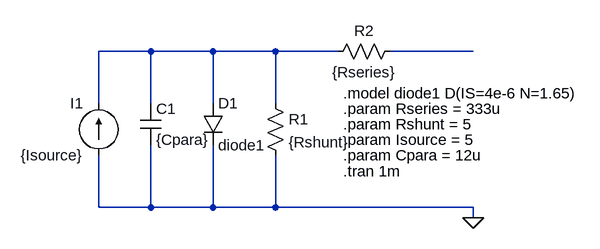
[diagram p0: schematic singlecell.asc]
singlecell.asc, the LTspice schematic file:
Version 4
SHEET 1 1844 680
WIRE 64 32 -16 32
WIRE 160 32 64 32
WIRE 256 32 160 32
WIRE 352 32 256 32
WIRE 560 32 432 32
WIRE -16 112 -16 32
WIRE 64 112 64 32
WIRE 160 112 160 32
WIRE 256 112 256 32
WIRE -16 272 -16 192
WIRE 64 272 64 176
WIRE 64 272 -16 272
WIRE 160 272 160 176
WIRE 160 272 64 272
WIRE 256 272 256 192
WIRE 256 272 160 272
WIRE 560 272 256 272
WIRE 560 288 560 272
FLAG 560 288 0
SYMBOL current -16 192 R180
WINDOW 0 24 80 Left 2
WINDOW 3 24 0 Left 2
WINDOW 123 0 0 Left 2
WINDOW 39 0 0 Left 2
SYMATTR InstName I1
SYMATTR Value {Isource}
SYMBOL cap 48 112 R0
SYMATTR InstName C1
SYMATTR Value {Cpara}
SYMBOL diode 144 112 R0
SYMATTR InstName D1
SYMATTR Value diode1
SYMBOL res 240 96 R0
SYMATTR InstName R1
SYMATTR Value {Rshunt}
SYMBOL res 448 16 R90
WINDOW 0 0 56 VBottom 2
WINDOW 3 32 56 VTop 2
SYMATTR InstName R2
SYMATTR Value {Rseries}
TEXT 360 96 Left 2 !.model diode1 D(IS=4e-6 N=1.65)
TEXT 360 216 Left 2 !.tran 1m
TEXT 360 144 Left 2 !.param Rshunt = 5
TEXT 360 120 Left 2 !.param Rseries = 333u
TEXT 360 192 Left 2 !.param Cpara = 12u
TEXT 360 168 Left 2 !.param Isource = 5

The netlist it stands for:
* singlecell.asc
I1 0 N001 {Isource}
C1 N001 0 {Cpara}
D1 N001 0 diode1
R1 N001 0 {Rshunt}
R2 N002 N001 {Rseries}
.model D D
.lib standard.dio
.model diode1 D(IS=4e-6 N=1.65)
.tran 1m
.param Rshunt = 5
.param Rseries = 333u
.param Cpara = 12u
.param Isource = 5
.backanno
.end